# EAGLE design serendipboard_v2 (EAGLE 9.6.2)

## Sheet 1 of 2
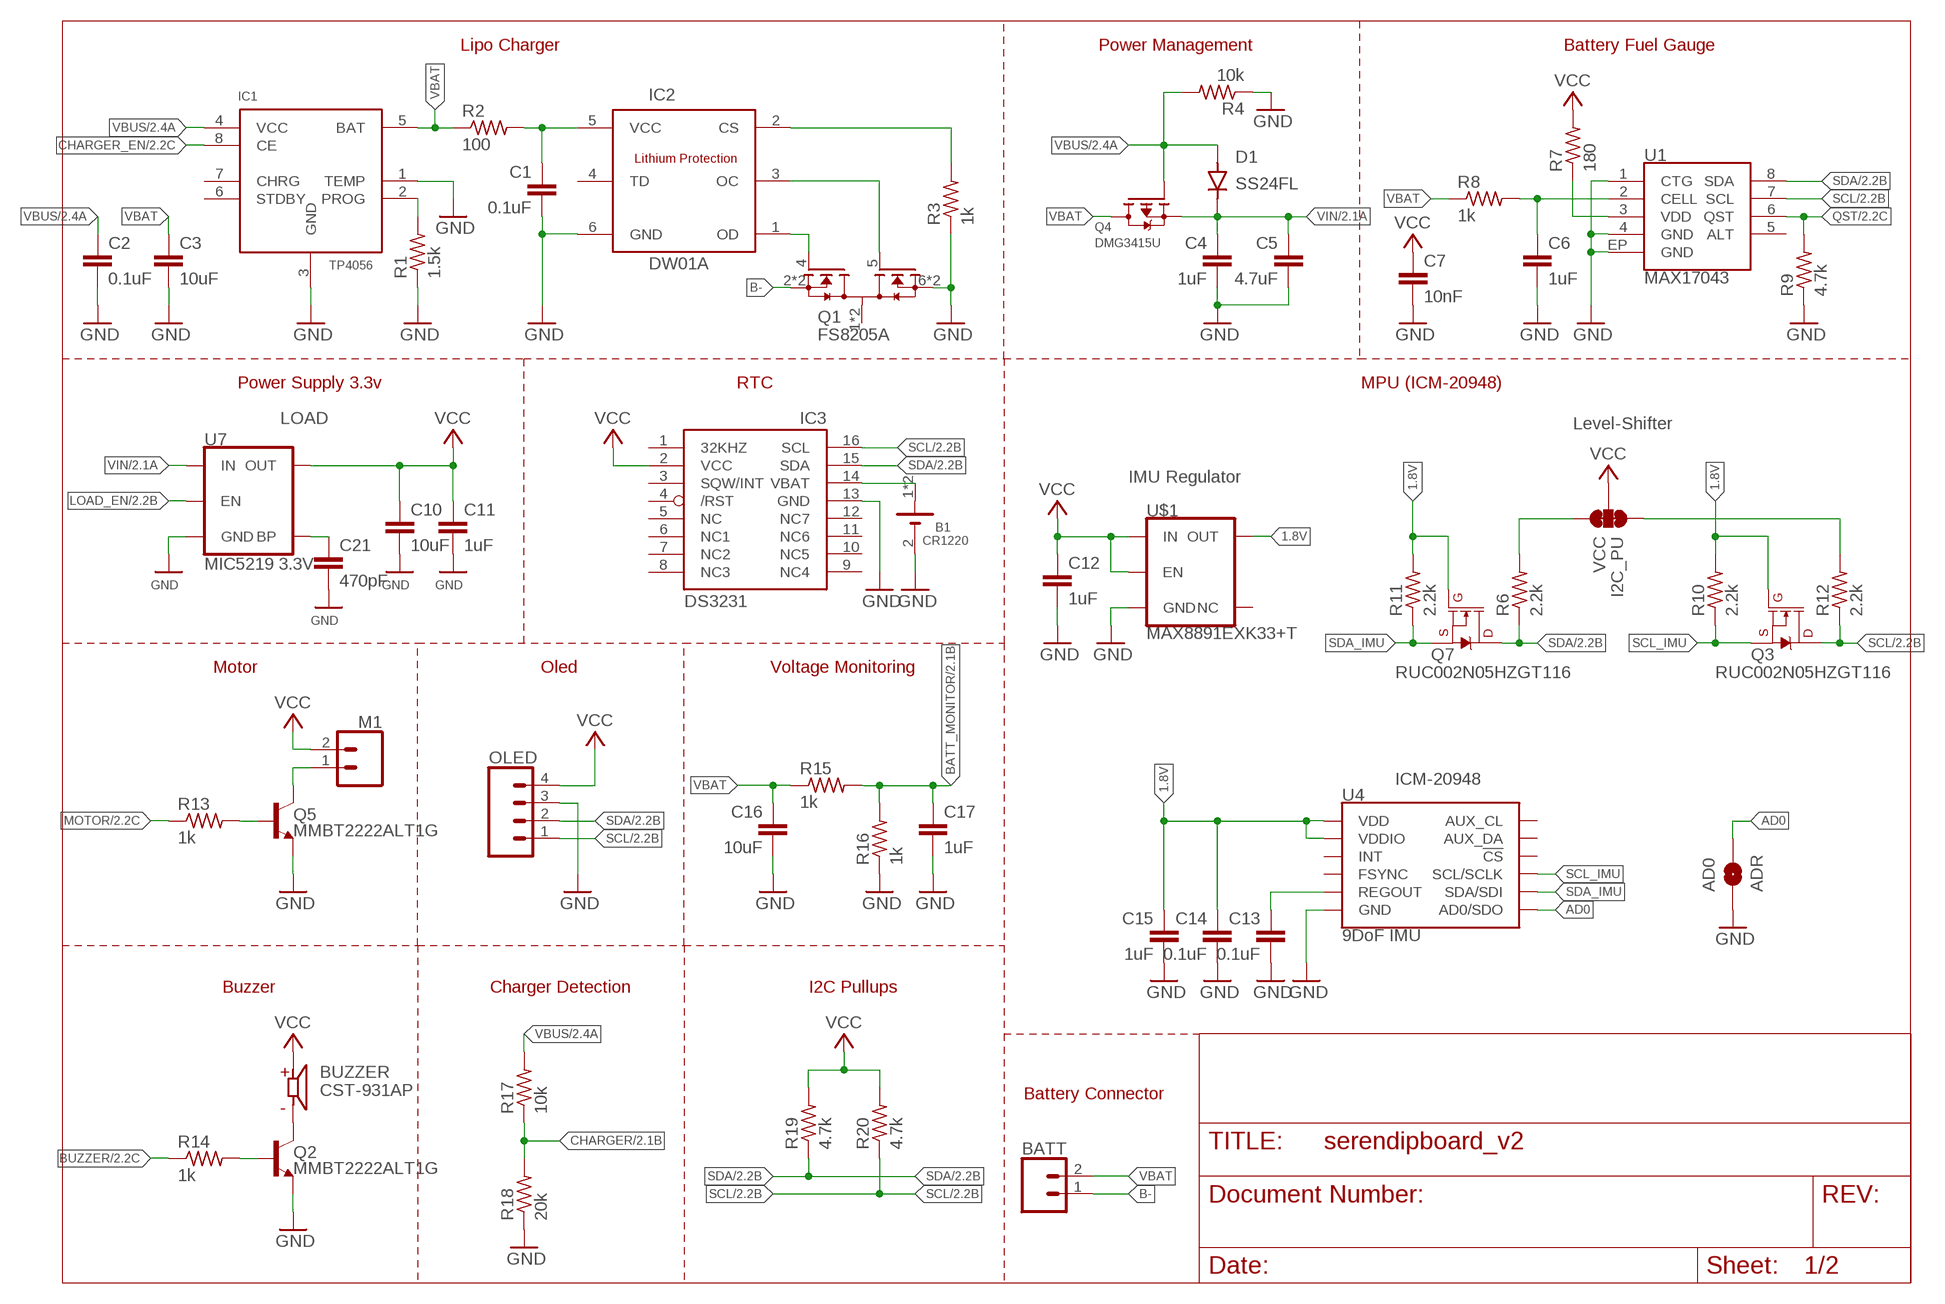
[diagram p0: schematic, sheet 1]

### Parts
AD0  ADR  JUMPER-SMT_2_NO_NO-SILK  [SMT-JUMPER_2_NO_NO-SILK]
B1  CR1220  3000TR  [BAT_3000TR]
BATT  CONN_02  [1X02]
BUZZER  CST-931AP  [CUI_CST-931AP]
C1  0.1uF  C-EUC0402  [C0402]
C2  0.1uF  C-EUC0402  [C0402]
C3  10uF  C-EUC0402  [C0402]
C4  1uF  C-EUC0402  [C0402]
C5  4.7uF  C-EUC0402  [C0402]
C6  1uF  C-EUC0402  [C0402]
C7  10nF  C-EUC0402  [C0402]
C10  10uF  C-EUC0402  [C0402]
C11  1uF  C-EUC0402  [C0402]
C12  1uF  C-EUC0402  [C0402]
C13  0.1uF  C-EUC0402  [C0402]
C14  0.1uF  C-EUC0402  [C0402]
C15  1uF  C-EUC0402  [C0402]
C16  10uF  C-EUC0402  [C0402]
C17  1uF  C-EUC0402  [C0402]
C21  470pF  C-EUC0402  [C0402]
D1  SS24FL  [SODFL3617X108N]
IC1  TP4056  [SOP-8]
IC2  DW01A  [SOT23-6]
IC3  DS3231/SO  [SO16W]
M1  CONN_02  [1X02]
OLED  CONN_04PTH  [1X04]
Q1  FS8205A  [SOP65P640X120-8N]
Q2  MMBT2222ALT1G  TRANS_NPN-MMBT2222AL  [SOT23-3]
Q3  RUC002N05HZGT116  MOSFET-NCH-AO3404A  [SOT23-3]
Q4  DMG3415U  MOSFET-P  [SOT23-R]
Q5  MMBT2222ALT1G  TRANS_NPN-MMBT2222AL  [SOT23-3]
Q7  RUC002N05HZGT116  MOSFET-NCH-AO3404A  [SOT23-3]
R1  1.5k  R-US_R0402  [R0402]
R2  100  R-US_R0402  [R0402]
R3  1k  R-US_R0402  [R0402]
R4  10k  R-US_R0402  [R0402]
R6  2.2k  R-US_R0402  [R0402]
R7  180  R-US_R0402  [R0402]
R8  1k  R-US_R0402  [R0402]
R9  4.7k  R-US_R0402  [R0402]
R10  2.2k  R-US_R0402  [R0402]
R11  2.2k  R-US_R0402  [R0402]
R12  2.2k  R-US_R0402  [R0402]
R13  1k  R-US_R0402  [R0402]
R14  1k  R-US_R0402  [R0402]
R15  1k  R-US_R0402  [R0402]
R16  1k  R-US_R0402  [R0402]
R17  10k  R-US_R0402  [R0402]
R18  20k  R-US_R0402  [R0402]
R19  4.7k  R-US_R0402  [R0402]
R20  4.7k  R-US_R0402  [R0402]
U1  MAX17043  MAX1704X  [TDFN-8]
U4  9DoF IMU  ICM-20948  [QFN24-3X3-ICM-20948]
U7  MIC5219 3.3V  V_REG_MIC52193.3V  [SOT23-5]
U$1  MAX8891EXK33+T  V_REG_SP6214-1.8V  [SC70]
VCC  I2C_PU  JUMPER-SMT_3_2-NC_TRACE_NO-SILK  [SMT-JUMPER_3_2-NC_TRACE_NO-SILK]

### Nets
1.8V: C14.1 C15.1 Q3.1(G) Q7.1(G) R10.2 R11.2 U4.8(VDDIO) U4.13(VDD) U$1.5(OUT)
AD0: AD0.2 U4.9(AD0/SDO)
B-: BATT.1 Q1.2(S1) Q1.3(S1)
BATT_MONITOR: C17.1 R15.2 R16.2 ; also sheet 2
BUZZER: R14.1 ; also sheet 2
CHARGER: R17.1 R18.2 ; also sheet 2
CHARGER_EN: IC1.8(CE) ; also sheet 2
GND: AD0.1 B1.2(-) C1.2 C2.2 C3.2 C4.2 C5.2 C6.2 C7.2 C10.2 C11.2 C12.2 C13.2 C14.2 C15.2 C16.2 C17.2 C21.2 IC1.1(TEMP) IC1.3(GND) IC2.6(GND) IC3.13(GND) OLED.3 Q1.6(S2) Q1.7(S2) Q2.2(E) Q5.2(E) R1.1 R3.1 R4.1 R9.1 R16.1 R18.1 U1.1(CTG) U1.4(GND) U1.EP(GND) U4.18(GND) U4.20(GND) U7.2(GND) U$1.2(GND) ; also sheet 2
LOAD_EN: U7.3(EN) ; also sheet 2
MOTOR: R13.1 ; also sheet 2
N$1: IC1.2(PROG) R1.2
N$2: IC2.3(OC) Q1.5(G2)
N$3: C1.1 IC2.5(VCC) R2.2
N$4: IC2.1(OD) Q1.4(G1)
N$5: IC2.2(CS) R3.2
N$6: R7.1 U1.3(VDD)
N$7: C6.1 R8.2 U1.2(CELL)
N$9: B1.1(+) B1.3(+) IC3.14(VBAT)
N$10: R6.2 VCC.3
N$11: C13.1 U4.10(REGOUT)
N$12: R12.2 VCC.1
N$13: Q5.1(B) R13.2
N$14: Q2.1(B) R14.2
N$17: M1.1 Q5.3(C)
N$19: BUZZER.M Q2.3(C)
N$25: C21.1 U7.4(BP)
QST: R9.2 U1.6(QST) ; also sheet 2
SCL: IC3.16(SCL) OLED.1 Q3.3(D) R12.1 R20.1 U1.7(SCL) ; also sheet 2
SCL_IMU: Q3.2(S) R10.1 U4.23(SCL/SCLK)
SDA: IC3.15(SDA) OLED.2 Q7.3(D) R6.1 R19.1 U1.8(SDA) ; also sheet 2
SDA_IMU: Q7.2(S) R11.1 U4.24(SDA/SDI)
VBAT: BATT.2 C3.1 C16.1 IC1.5(BAT) Q4.3(D) R2.1 R8.1 R15.1
VBUS: C2.1 D1.A IC1.4(VCC) Q4.1(G) R4.2 R17.2 ; also sheet 2
VCC: BUZZER.P C7.1 C10.1 C11.1 C12.1 IC3.2(VCC) M1.2 OLED.4 R7.2 R19.2 R20.2 U7.5(OUT) U$1.1(IN) U$1.3(EN) VCC.2
VIN: C4.1 C5.1 D1.C Q4.2(S) U7.1(IN) ; also sheet 2
Unconnected: IC1.6(STDBY) IC1.7(CHRG) IC2.4(TD) IC3.1(32KHZ) IC3.3(SQW/INT) IC3.4(/RST) IC3.5(NC) IC3.6(NC1) IC3.7(NC2) IC3.8(NC3) IC3.9(NC4) IC3.10(NC5) IC3.11(NC6) IC3.12(NC7) Q1.1(D12) Q1.8(D12) U1.5(ALT) U4.7(AUX_CL) U4.11(FSYNC) U4.12(INT) U4.21(AUX_DA) U4.22(!CS) U$1.4(NC)

### Notes on the sheet
- Lipo Charger | Power Management | Battery Fuel Gauge
- Power Supply 3.3v | RTC | MPU (ICM-20948)
- LOAD
- Level-Shifter
- IMU Regulator
- Motor | Oled | Voltage Monitoring
- ICM-20948
- Buzzer | Charger Detection | I2C Pullups
- Battery Connector

## Sheet 2 of 2
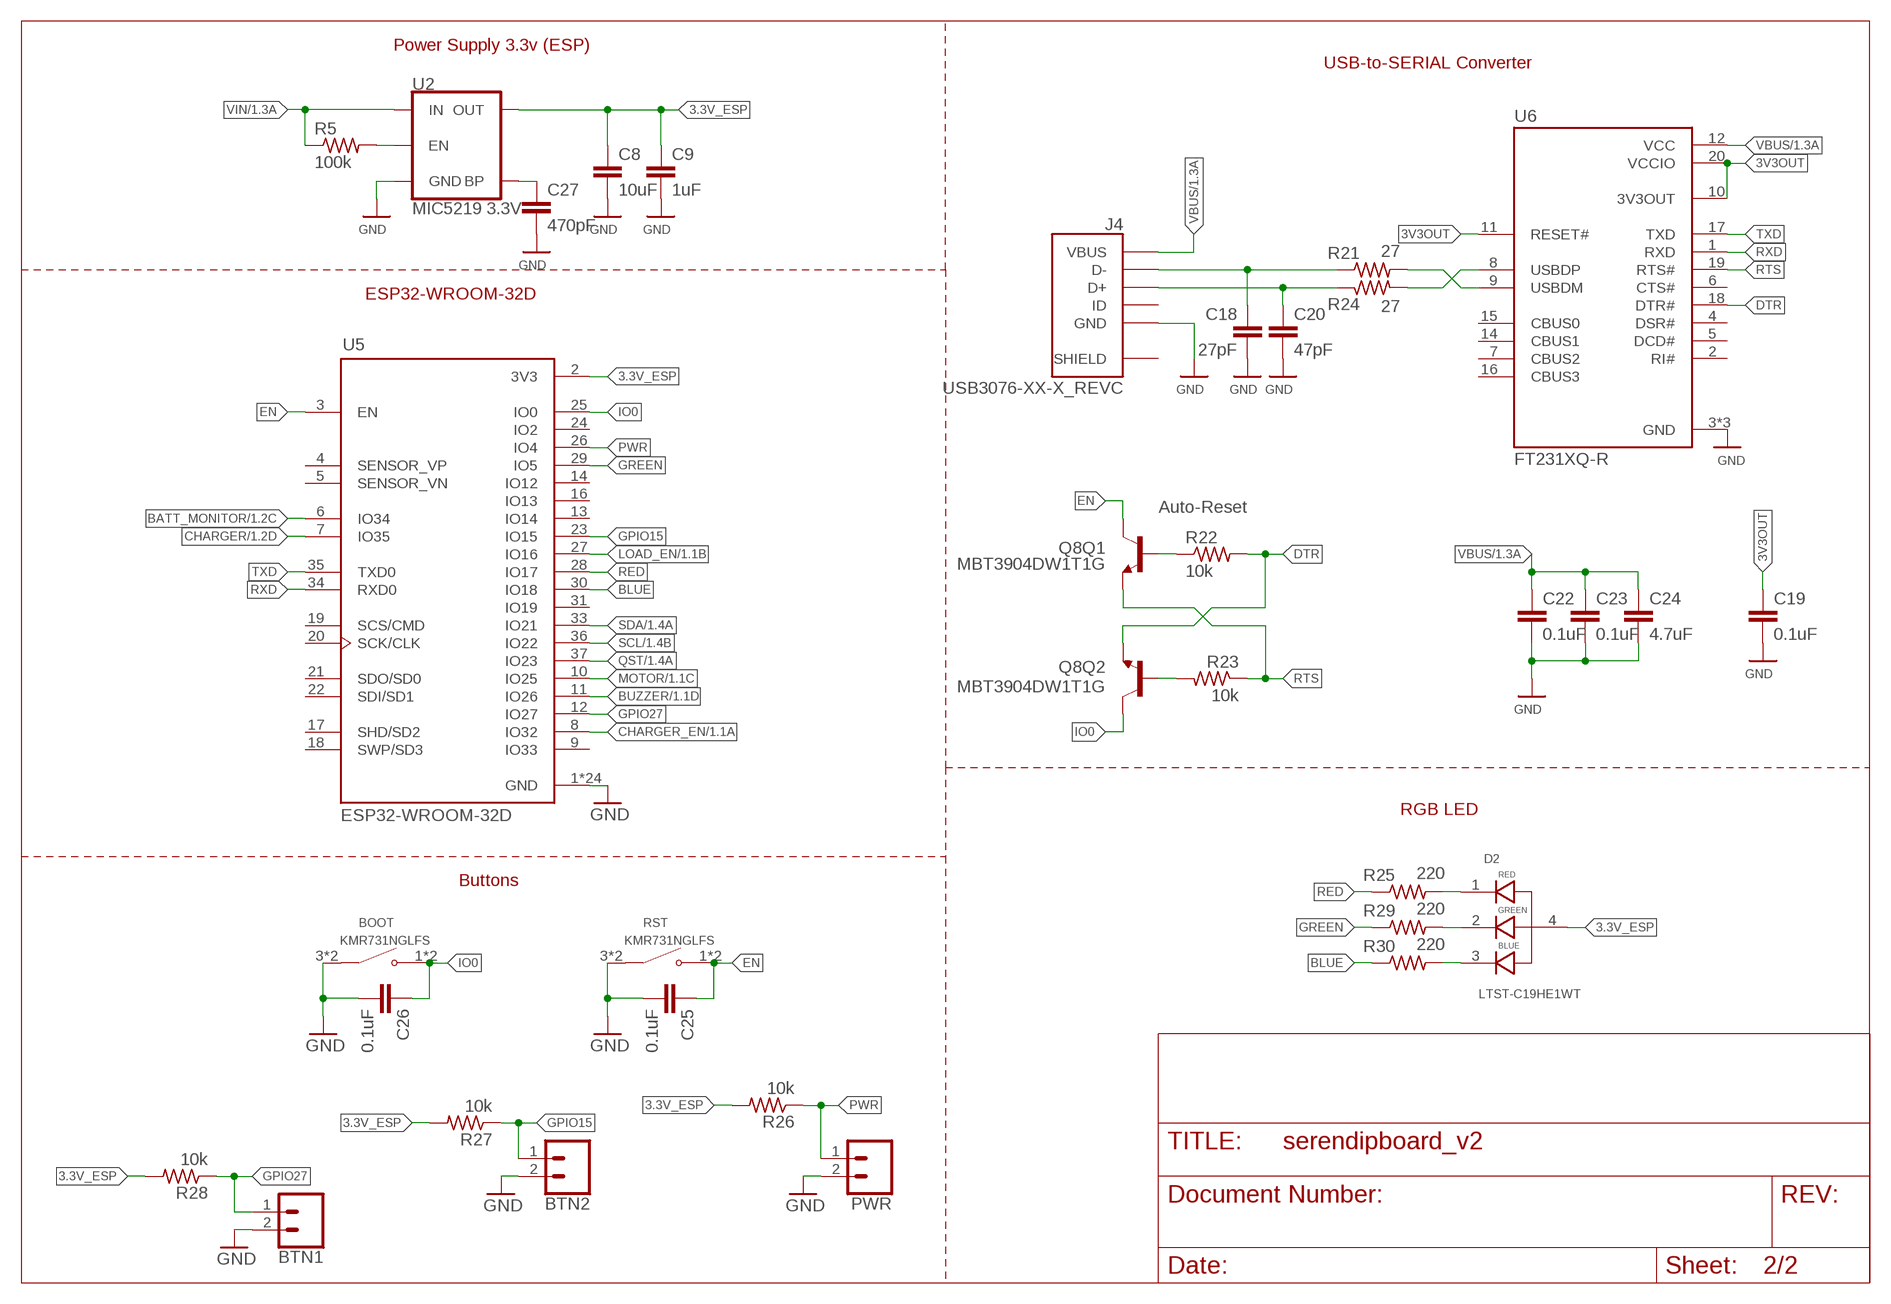
[diagram p1: schematic, sheet 2]

### Parts
BOOT  KMR731NGLFS  [SW_KMR731NGLFS]
BTN1  CONN_02  [1X02]
BTN2  CONN_02  [1X02]
C8  10uF  C-EUC0402  [C0402]
C9  1uF  C-EUC0402  [C0402]
C18  27pF  C-EUC0402  [C0402]
C19  0.1uF  C-EUC0402  [C0402]
C20  47pF  C-EUC0402  [C0402]
C22  0.1uF  C-EUC0402  [C0402]
C23  0.1uF  C-EUC0402  [C0402]
C24  4.7uF  C-EUC0402  [C0402]
C25  0.1uF  C-EUC0402  [C0402]
C26  0.1uF  C-EUC0402  [C0402]
C27  470pF  C-EUC0402  [C0402]
D2  LTST-C19HE1WT  [LED_LTST-C19HE1WT]
J4  USB3076-XX-X_REVC  [GCT_USB3076-XX-X_REVC]
PWR  CONN_02  [1X02]
Q8  MBT3904DW1T1G  TRANS_NPN_DUAL-MBT3904DW1T1  [SC70-6]
R5  100k  R-US_R0402  [R0402]
R21  27  R-US_R0402  [R0402]
R22  10k  R-US_R0402  [R0402]
R23  10k  R-US_R0402  [R0402]
R24  27  R-US_R0402  [R0402]
R25  220  R-US_R0402  [R0402]
R26  10k  R-US_R0402  [R0402]
R27  10k  R-US_R0402  [R0402]
R28  10k  R-US_R0402  [R0402]
R29  220  R-US_R0402  [R0402]
R30  220  R-US_R0402  [R0402]
RST  KMR731NGLFS  [SW_KMR731NGLFS]
U2  MIC5219 3.3V  V_REG_MIC52193.3V  [SOT23-5]
U5  ESP32-WROOM-32D  [MODULE_ESP32-WROOM-32D]
U6  FT231XQ-R  [QFN50P400X400X80-21N]

### Nets
3.3V_ESP: C8.1 C9.1 D2.4 R26.2 R27.2 R28.2 U2.5(OUT) U5.2(3V3)
3V3OUT: C19.1 U6.10(3V3OUT) U6.11(RESET#) U6.20(VCCIO)
BATT_MONITOR: U5.6(IO34) ; also sheet 1
BLUE: R30.1 U5.30(IO18)
BUZZER: U5.11(IO26) ; also sheet 1
CHARGER: U5.7(IO35) ; also sheet 1
CHARGER_EN: U5.8(IO32) ; also sheet 1
DTR: Q8.1(Q2:E) R22.2 U6.18(DTR#)
EN: C25.1 Q8.3(Q1:C) RST.1(NO) RST.2(NO) U5.3(EN)
GND: BOOT.3(COM) BOOT.4(COM) BTN1.2 BTN2.2 C8.2 C9.2 C18.2 C19.2 C20.2 C22.2 C23.2 C24.2 C25.2 C26.2 C27.2 J4.5(GND) PWR.2 RST.3(COM) RST.4(COM) U2.2(GND) U5.1(GND) U5.15(GND) U5.38(GND) U5.39_1(GND) U5.39_2(GND) U5.39_3(GND) U5.39_4(GND) U5.39_5(GND) U5.39_6(GND) U5.39_7(GND) U5.39_8(GND) U5.39_9(GND) U5.39_10(GND) U5.39_11(GND) U5.39_12(GND) U5.39_13(GND) U5.39_14(GND) U5.39_15(GND) U5.39_16(GND) U5.39_17(GND) U5.39_18(GND) U5.39_19(GND) U5.39_20(GND) U5.39_21(GND) U6.3(GND) U6.13(GND) U6.21(GND) ; also sheet 1
GPIO15: BTN2.1 R27.1 U5.23(IO15)
GPIO27: BTN1.1 R28.1 U5.12(IO27)
GREEN: R29.1 U5.29(IO5)
IO0: BOOT.1(NO) BOOT.2(NO) C26.1 Q8.6(Q2:C) U5.25(IO0)
LOAD_EN: U5.27(IO16) ; also sheet 1
MOTOR: U5.10(IO25) ; also sheet 1
N$8: C27.1 U2.4(BP)
N$15: Q8.5(Q1:B) R22.1
N$16: C18.1 J4.2(D-) R21.1
N$18: Q8.2(Q2:B) R23.2
N$20: R21.2 U6.9(USBDM)
N$21: C20.1 J4.3(D+) R24.1
N$22: R24.2 U6.8(USBDP)
N$23: R5.2 U2.3(EN)
N$24: D2.1 R25.2
N$26: D2.2 R29.2
N$27: D2.3 R30.2
PWR: PWR.1 R26.1 U5.26(IO4)
QST: U5.37(IO23) ; also sheet 1
RED: R25.1 U5.28(IO17)
RTS: Q8.4(Q1:E) R23.1 U6.19(RTS#)
RXD: U5.34(RXD0) U6.1(RXD)
SCL: U5.36(IO22) ; also sheet 1
SDA: U5.33(IO21) ; also sheet 1
TXD: U5.35(TXD0) U6.17(TXD)
VBUS: C22.1 C23.1 C24.1 J4.1(VBUS) U6.12(VCC) ; also sheet 1
VIN: R5.1 U2.1(IN) ; also sheet 1
Unconnected: J4.4(ID) U5.4(SENSOR_VP) U5.5(SENSOR_VN) U5.9(IO33) U5.13(IO14) U5.14(IO12) U5.16(IO13) U5.17(SHD/SD2) U5.18(SWP/SD3) U5.19(SCS/CMD) U5.20(SCK/CLK) U5.21(SDO/SD0) U5.22(SDI/SD1) U5.24(IO2) U5.31(IO19) U6.2(RI#) U6.4(DSR#) U6.5(DCD#) U6.6(CTS#) U6.7(CBUS2) U6.14(CBUS1) U6.15(CBUS0) U6.16(CBUS3)

### Notes on the sheet
- Power Supply 3.3v (ESP)
- USB-to-SERIAL Converter
- ESP32-WROOM-32D
- Auto-Reset
- RGB LED
- Buttons

## Power pins joined to a net without a drawn wire
SHIELD: J4.6(SHIELD) J4.7(SHIELD) J4.8(SHIELD) J4.9(SHIELD) J4.10(SHIELD) J4.11(SHIELD)

## Library data of the parts
AD0 = SparkFun-Jumpers:JUMPER-SMT_2_NO: Normally open jumper This jumper has two pads in close proximity to each other. Apply solder to close the connection. Round pads are easier to solder for beginners, but are a lot larger. SparkFun Product that uses the round pads: SparkFun EL Sequencer <https://www.sparkfun.com/products/12781>
B1 = 3000TR:3000TR: Ultra Low Profile SMT Coin Cell Battery Contact Retainer for 12 mm Cell Check prices <https://pricing.snapeda.com/parts/3000TR/Keystone/view-part?ref=eda>; AVAILABILITY: Warning; DESCRIPTION: SMT Holder for 12mm Cell-Tin Nickel Plate on T&R; MF: Keystone; MP: 3000TR; PACKAGE: None; PRICE: None; PURCHASE-URL: https://pricing.snapeda.com/search/part/3000TR/?ref=eda; WEBLINK: https://www.mouser.com/ProductDetail/Keystone-Electronics/3000TR?utm_medium=online&utm_content=model&utm_source=snapedaonline&utm_campaign=mouser&qs=811De8TLL%252BeRUCmGL5ZsKg%3D%3D
BATT BTN1 BTN2 M1 PWR = SparkFun-Connectors:CONN_02: Multi connection point. Often used as Generic Header-pin footprint for 0.1 inch spaced/style header connections On any of the 0.1 inch spaced packages, you can populate with these: Break Away Headers - Straight <https://www.sparkfun.com/products/116> (PRT-00116) Break Away Male Headers - Right Angle <https://www.sparkfun.com/products/553> (PRT-00553) Female Headers <https://www.sparkfun.com/products/115> (PRT-00115) Break Away Headers - Machine Pin <https://www.sparkfun.com/products/117> (PRT-00117) Break Away Female Headers - Swiss Machine Pin <https://www.sparkfun.com/products/743> (PRT-00743) For SCREWTERMINALS and SPRING TERMINALS visit here: Screw Terimnals on SparkFun.com <https://www.sparkfun.com/search/results?term=Screw+Terminals> (5mm/3.5mm/2.54mm spacing) This device is also useful as a general connection point to wire up your design to another part of your project. Our various solder wires solder well into these plated through hole pads. Hook-Up Wire - Assortment (Stranded, 22 AWG) <https://www.sparkfun.com/products/11375> (PRT-11375) Hook-Up Wire - Assortment (Solid Core, 22 AWG) <https://www.sparkfun.com/products/11367> (PRT-11367) View the entire wire category on our website here <https://www.sparkfun.com/categories/141> Special notes: Molex polarized connector foot print use with: PRT-08233 with associated crimp pins and housings. 2.54_SCREWTERM for use with PRT-10571. 3.5mm Screw Terminal footprints for PRT-08084 5mm Screw Terminal footprints for use with PRT-08432
BOOT RST = KMR731NGLFS:KMR731NGLFS: Tactile Switch SPST-NO Top Actuated Surface Mount Check prices <https://pricing.snapeda.com/parts/KMR731NGLFS/C%26K/view-part?ref=eda>; AVAILABILITY: Good; DESCRIPTION: Tactile Switch SPST-NO Top Actuated Surface Mount; MF: C&K; MP: KMR731NGLFS; PACKAGE: None; PRICE: None; PURCHASE-URL: https://pricing.snapeda.com/search/part/KMR731NGLFS/?ref=eda; WEBLINK: https://www.mouser.com/ProductDetail/CK/KMR731NGLFS?utm_medium=online&utm_source=snapedaonline&utm_content=model&utm_campaign=mouser&qs=HXFqYaX1Q2zvDMPiZo53qg%3D%3D
BUZZER = CST-931AP:CST-931AP: 9 mm, 3 V, 85 dB, Through Hole, Magnetic Audio Transducer Buzzer Check prices <https://pricing.snapeda.com/parts/CST-931AP/CUI%20Devices/view-part?ref=eda>; AVAILABILITY: Good; CUI_PURCHASE_URL: https://www.cuidevices.com/product/audio/buzzers/audio-transducers/cst-931ap?utm_source=snapeda.com&utm_medium=referral&utm_campaign=snapedaBOM; DESCRIPTION: 9 mm, 3 V, 85 dB, Through Hole, Magnetic Audio Transducer Buzzer; MF: CUI Devices; MP: CST-931AP; PACKAGE: CUI Inc.; PRICE: None; PURCHASE-URL: https://pricing.snapeda.com/search/part/CST-931AP/?ref=eda
C1-C20 C22-C26 = rcl:C-EU: CAPACITOR, European symbol; SPICEPREFIX: C
C21 C27 = rcl:C-EU: CAPACITOR, European symbol; SPICEPREFIX: C; WEBLINK: https://www.mouser.com/ProductDetail/KEMET/C0402C471J1GACAUTO?qs=sGAEpiMZZMukHu%252BjC5l7YWbgIG6EVcU0CY2rIdfmFUs%3D
D1 = SS24FL:SS24FL: Diode Schottky Barrier Rectifier 30V 1A 2-Pin SOD-123F T/R Check prices <https://pricing.snapeda.com/parts/SS24FL/ON%20Semiconductor/view-part?ref=eda>; AVAILABILITY: Good; DESCRIPTION: Diode Schottky 40V 2A Surface Mount SOD-123F; MF: ON Semiconductor; MP: SS24FL; PACKAGE: SOD-123 FL-2 ON Semiconductor; PRICE: None; PURCHASE-URL: https://pricing.snapeda.com/search/part/SS24FL/?ref=eda; WEBLINK: https://www.mouser.com/ProductDetail/ON-Semiconductor-Fairchild/SS24FL?qs=%2Fha2pyFaduj7KkQLupkD5BNnzhQnWfnoQdoJ200unmI%3D
D2 = LTST-C19HE1WT:LTST-C19HE1WT: Red, Green, Blue (RGB) 624nm Red, 525nm Green, 470nm Blue LED Indication - Discrete 2.1V Red, 3.35V Green, 3.35V Blue 0606 (1616 Metric) Check prices <https://pricing.snapeda.com/parts/LTST-C19HE1WT/Lite-On%20Electronics/view-part?ref=eda>; AVAILABILITY: Good; DESCRIPTION: LED Tri-Color Blue/Green/Red 468nm/520nm/632nm 4-Pin SMD T/R; MF: Lite-On Electronics; MP: LTST-C19HE1WT; PACKAGE: None; PRICE: None; PURCHASE-URL: https://pricing.snapeda.com/search/part/LTST-C19HE1WT/?ref=eda; WEBLINK: https://www.mouser.com/ProductDetail/Lite-On/LTST-C19HE1WT?qs=WAWaI72GHKxJLPArJA9%252BUw%3D%3D&utm_campaign=mouser&utm_content=model&utm_source=snapedaonline&utm_medium=online
IC1 = TP4056:TP4056; AVAILABILITY: Unavailable; DESCRIPTION: Complete single cell Li-Ion battery with a constant current / constant voltage linear charger; MF: NanJing Top Power ASIC Corp.; MP: TP4056; PACKAGE: Package; PRICE: None; WEBLINK: https://lcsc.com/product-detail/PMIC-Battery-Management_UMW-Youtai-Semiconductor-Co-Ltd-TP4056_C725790.html
IC2 = DW01A:DW01A; AVAILABILITY: Unavailable; DESCRIPTION: One Cell Lithium-ion/Polymer Battery Protection IC; MF: Fortune Semiconductor; MP: DW01A; PACKAGE: SOT-23-6 Fortune Semiconductor; PRICE: None; WEBLINK: https://lcsc.com/product-detail/Battery-Protection-ICs_PUOLOP-DW01A_C351410.html
IC3 = DS3231:DS3231; AVAILABILITY: Unavailable; DESCRIPTION: Real Time Clock (RTC) IC Clock/Calendar I²C, 2-Wire Serial 16-SOIC (0.295, 7.50mm Width); MF: Maxim Integrated; MP: DS3231; PACKAGE: SOIC-16 Maxim Integrated; PRICE: None; WEBLINK: https://www.mouser.com/ProductDetail/Maxim-Integrated/DS3231SN?qs=1eQvB6Dk1vhUlr8%2FOrV0Fw%3D%3D
J4 = USB3076-30-A:USB3076-XX-X_REVC: Micro USB Receptacle, Type B, SMT, Horizontal, Bottom Mount w/out Peg, w/out Shell Stakes, w/out Mating Face Lead-In Check prices <https://pricing.snapeda.com/parts/USB3076-30-A/Global%20Connector%20Technology/view-part?ref=eda>; AVAILABILITY: Warning; DESCRIPTION: USB - micro B USB 2.0 Receptacle Connector 5 Position Surface Mount, Right Angle; Through Hole, 2.35mm profile, 5 Pins, Horizontal, Bottom mount; MF: Global Connector Technology; MP: USB3076-30-A; PACKAGE: None; PRICE: None; PURCHASE-URL: https://pricing.snapeda.com/search/part/USB3076-30-A/?ref=eda; WEBLINK: https://www.digikey.com/en/products/detail/gct/USB3076-30-A/9859635?s=N4IgTCBcDaIKoGUBCBmADAdgGwFp04EEQBdAXyA
OLED = SparkFun-Connectors:CONN_04: Multi connection point. Often used as Generic Header-pin footprint for 0.1 inch spaced/style header connections On any of the 0.1 inch spaced packages, you can populate with these: Break Away Headers - Straight <https://www.sparkfun.com/products/116> (PRT-00116) Break Away Male Headers - Right Angle <https://www.sparkfun.com/products/553> (PRT-00553) Female Headers <https://www.sparkfun.com/products/115> (PRT-00115) Break Away Headers - Machine Pin <https://www.sparkfun.com/products/117> (PRT-00117) Break Away Female Headers - Swiss Machine Pin <https://www.sparkfun.com/products/743> (PRT-00743) For SCREWTERMINALS and SPRING TERMINALS visit here: Screw Terimnals on SparkFun.com <https://www.sparkfun.com/search/results?term=Screw+Terminals> (5mm/3.5mm/2.54mm spacing) This device is also useful as a general connection point to wire up your design to another part of your project. Our various solder wires solder well into these plated through hole pads. Hook-Up Wire - Assortment (Stranded, 22 AWG) <https://www.sparkfun.com/products/11375> (PRT-11375) Hook-Up Wire - Assortment (Solid Core, 22 AWG) <https://www.sparkfun.com/products/11367> (PRT-11367) View the entire wire category on our website here <https://www.sparkfun.com/categories/141> Special notes: Molex polarized connector foot print use with SKU : PRT-08231 with associated crimp pins and housings. 1MM SMD Version SKU: PRT-10208; PROD_ID: CONN-09696
Q1 = FS8205A:FS8205A: N/A; AVAILABILITY: Unavailable; MF: Fortune Semiconductor; MP: FS8205A; PACKAGE: Package; PRICE: None; WEBLINK: https://lcsc.com/product-detail/MOSFET_FUXINSEMI-FS8205A_C908265.html
Q2 Q5 = SparkFun-DiscreteSemi:TRANS_NPN: NPN transistor Current controlled devices typically used to amplify current or used as a switch. BC547 - COM-08928 <http://www.sparkfun.com/products/8928> (TO-92 45V 100mA) (1.Collector 2.Base 3.Emitter) 2N3904 - COM-00521 <http://www.sparkfun.com/products/521> (TO-92 40V 200mA) (1.Emitter 2.Base 3.Collector) P2N2222A - COM-12852 <http://www.sparkfun.com/products/12852> (TO-92 40V 600mA) (1.Collector 2.Base 3.Emitter); PROD_ID: TRANS-08049; VALUE: 600mA/40V; WEBLINK: https://www.mouser.com/ProductDetail/ON-Semiconductor/MMBT2222ALT1G?qs=HVbQlW5zcXWwnD7Jokybqg%3D%3D
Q3 Q7 = SparkFun-DiscreteSemi:MOSFET-NCH: N-channel MOSFETs Voltage controlled devices that allow control of high current outputs. SparkFun Products: SparkFun OpenScale <https://www.sparkfun.com/products/13261> SparkFun Digital Sandbox <https://www.sparkfun.com/products/12651> SparkFun Monster Moto Shield <https://www.sparkfun.com/products/10182> SparkFun MOSFET Power Controller <https://www.sparkfun.com/products/11214>; PROD_ID: TRANS-12988; VALUE: 5.8A/30V/35mΩ; WEBLINK: https://www.mouser.com/ProductDetail/ROHM-Semiconductor/RUC002N05HZGT116?qs=4v%252BiZTmLVHE0lwSK%2FDyNsA%3D%3D
Q4 = microbuilder:MOSFET-P: P-Channel Mosfet LEGEND VDS: Voltage Drain-Source ID: Drain Current RDS(ON): Drain-Source On-State Resistance VGS(TH): Gate-Source Threshold Voltage CISS: Drain-Source Input Capacitance SOT-23 Name VDS ID RDS(ON) VGS(TH) CISS Order Number IRLML5103 30V 760mA 600 mOhm -- 75pF @ 25V Digikey: IRLML5103PBFCT-ND IRLML6401 12V 4.3A 50 mOhm 950mV @ 250µA 830pF @ 10V Digikey: IRLML6401PBFTR-ND NTR0202PL 20V 400mA 800 mOhm 2.3V @ 250uA 70pF @ 5V Digikey: NTR0202PLT1GOSTR-ND NTR4101PT1G 20V 1.8A 85 mOhm 1.2V @ 250uA 675pF @ 10V Digikey: NTR4101PT1GOSCT-ND DMP2004K 20V 600mA 900 mOhm 1V @ 250uA 175pF @ 16V Digikey: DMP2004KDICT-ND PMV65XP 20V 3.9A 76 mOhm 950mV @ 1mA 725pF @ 20V Digikey: 568-2358-2-ND TO-252 Name VDS ID RDS(ON) VGS(TH) CISS Order Number AOD417 30V 25A 34 mOhm 3V @ 250µA 920pF @ 15V Digikey: 785-1106-2-ND; WEBLINK: https://www.arrow.com/en/products/dmg3415uq-7/diodes-incorporated
Q8 = SparkFun-DiscreteSemi:TRANS_NPN_DUAL: Dual NPN Transistors in Single Package The MBT3904W1 puts two general purpose 3904 NPN transistors in a single package. Datasheet <http://www.onsemi.com/pub_link/Collateral/MBT3904DW1T1-D.PDF> SparkFun Products: SparkFun ESP32 Thing <https://www.sparkfun.com/products/13907>; PROD_ID: TRANS-13337; WEBLINK: https://www.mouser.com/ProductDetail/ON-Semiconductor/MBT3904DW1T1G?qs=3JMERSakebosaBSFCYL6kw%3D%3D
R1-R20 R22 R23 R25-R30 = rcl:R-US_: RESISTOR, American symbol; SPICEPREFIX: R
R21 R24 = rcl:R-US_: RESISTOR, American symbol; SPICEPREFIX: R; WEBLINK: https://www.mouser.com/ProductDetail/Panasonic/ERJ-UP3F27R0V?qs=GedFDFLaBXEZtGKa4W2A1A%3D%3D
U1 = SparkFun-IC-Power:MAX1704X: MAX17043/MAX17044: Battery Fuel Guage (43 is 1cell, 44 is 2cell); PROD-ID: IC-10399; WEBLINK: https://www.mouser.com/ProductDetail/Maxim-Integrated/MAX17043G%2bT?qs=fnYUjNMxfVCghHGFBrnbRA%3D%3D
U2 U7 = SparkFun-IC-Power:V_REG_MIC5219: V_REG MIC5219 Standard 3.3V and 5V 500mA LDO voltage regulator in SOT-23 layout. Micrel part MIC5219. BP (by-pass) pin is used to lower output noise with 470pF cap, may be left open.; PROD_ID: VREG-09872; WEBLINK: https://www.mouser.com/ProductDetail/Microchip-Technology-Micrel/MIC5219-33YM5-TR?qs=U6T8BxXiZAWojkIJMtSJlw%3D%3D
U4 = SparkFun-Sensors:ICM-20948: ICM-20948 9 Degree of Freedom IMU World’s lowest power 9-axis MotionTracking device that is ideally suited for smartphones, tablets, wearable sensors, and IoT applications. Includes onboard Digital Motion Processor to offload computations from the host processor Datasheet <https://cdn.sparkfun.com/assets/learn_tutorials/5/5/0/MPU9250REV1.0.pdf> SparkFun Products: SparkFun IMU Breakout - ICM-20948 <https://www.sparkfun.com/products/15182>; PROD_ID: IC-14247; WEBLINK: https://www.mouser.com/ProductDetail/TDK-InvenSense/ICM-20948?qs=%2Fha2pyFaduhVfJfZCXoikyvvC70YiWC%2FBNr%2FvcBEr1bv7usabPFmkg%3D%3D
U5 = ESP32-WROOM-32D:ESP32-WROOM-32D: Bluetooth, WiFi 802.11b/g/n, Bluetooth v4.2 + EDR, Class 1, 2 and 3 Transceiver Module 2.4GHz ~ 2.5GHz Integrated, Trace Surface Mount Check prices <https://pricing.snapeda.com/parts/ESP32-WROOM-32D/Espressif%20Systems/view-part?ref=eda>; AVAILABILITY: Bad; DESCRIPTION: Bluetooth, WiFi 802.11b/g/n, Bluetooth v4.2 +EDR, Class 1, 2 and 3 Transceiver Module 2.4GHz ~ 2.5GHz Integrated; MF: Espressif Systems; MP: ESP32-WROOM-32D; PACKAGE: Module Espressif Systems; PRICE: None; WEBLINK: https://www.mouser.com/ProductDetail/Espressif-Systems/ESP32-WROOM-32DM113DH2800PH3Q0?qs=W%2FMpXkg%252BdQ75%2Fda1rSxxJw%3D%3D
U6 = FT231XQ-R:FT231XQ-R: USB2.0 Full Speed IC offers a compact bridge to full handshake UART Interface Check prices <https://pricing.snapeda.com/parts/FT231XQ-R/FTDI%2C%20Future/view-part?ref=eda>; AVAILABILITY: Warning; DESCRIPTION: USB Bridge, USB to UART USB 2.0 UART Interface 20-QFN (4x4); MF: FTDI, Future; MP: FT231XQ-R; PACKAGE: QFN-20 FTDI; PRICE: None; PURCHASE-URL: https://pricing.snapeda.com/search/part/FT231XQ-R/?ref=eda; WEBLINK: https://www.mouser.com/ProductDetail/FTDI/FT231XQ-R?qs=Gp1Yz1mis3VkAf3iW%252BkumQ==
U$1 = SparkFun-IC-Power:V_REG_SP6214: Voltage Regulator - SP6214 SP6214 Series SC-70-5 Micropower SC-70 100 mA CMOS LDO Regulator Datasheet <https://www.exar.com/content/document.ashx?id=654> SparkFun Products: MP3 Trigger <https://www.sparkfun.com/products/13720> SparkFun Particle Sensor Breakout <https://www.sparkfun.com/products/14045>; PROD_ID: VREG-08428; VALUE: 1.8V/100mA; WEBLINK: https://www.mouser.com/ProductDetail/STMicroelectronics/LD39015M18R?qs=%2Fha2pyFaduiNd%2F2UEBkaLCKjQ2zo%2FZOF5RG39Zh4PEGsBkDRy2IG8Q%3D%3D
VCC = SparkFun-Jumpers:JUMPER-SMT_3_2-NC_TRACE: Normally closed trace jumper (2 of 2 connections) This jumper has a trace between all three pads so they are normally closed (NC). Use a razor knife to open the connection(s). For best results follow the IPC guidelines for cutting traces: Cutout at least 0.063 mm (0.005 in). Remove all loose material to clean up the cut area. Seal the cut with an approved epoxy. Reapply solder to reclose the connection(s).

## Board
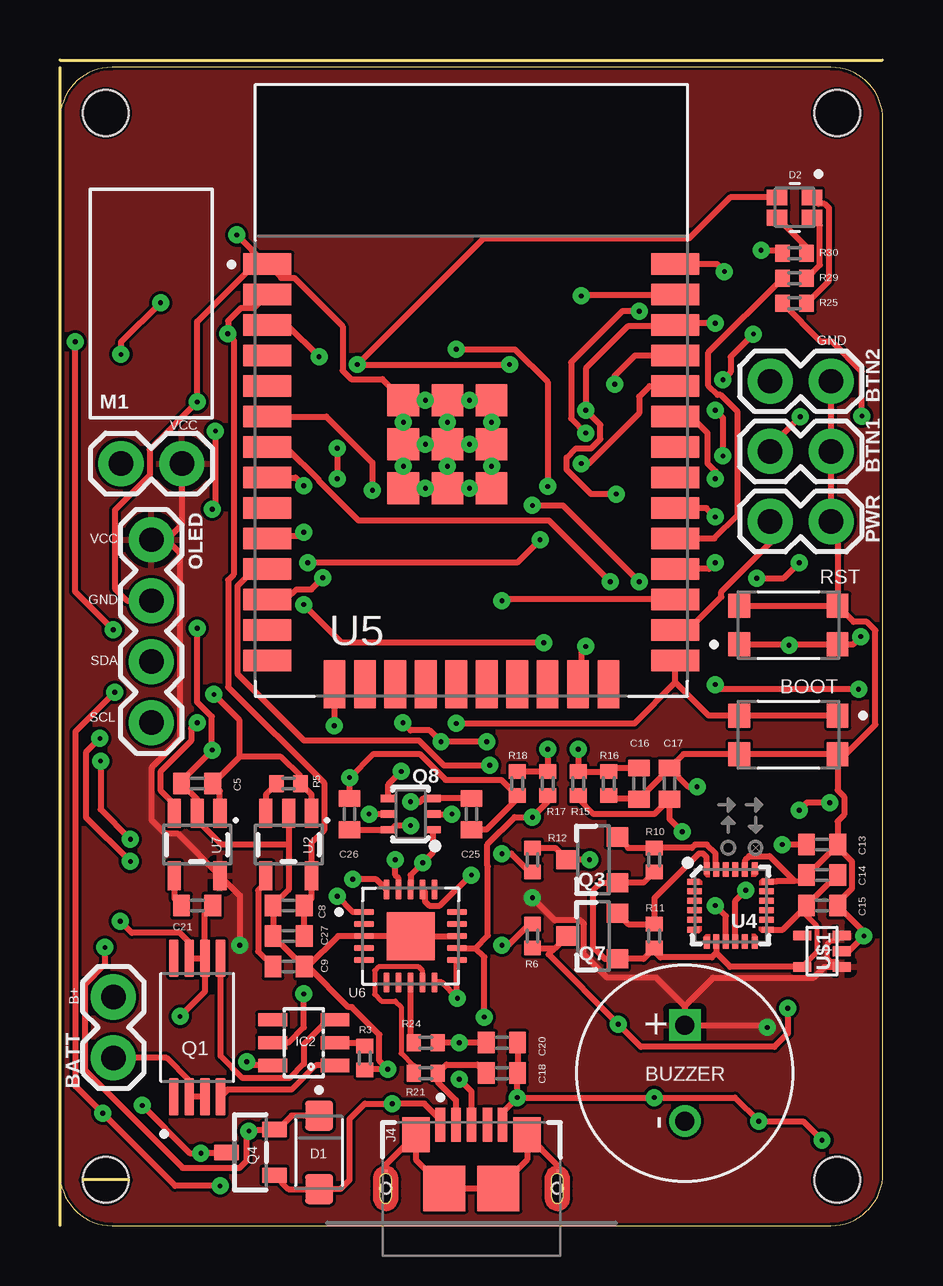
[diagram p2: board, top side]
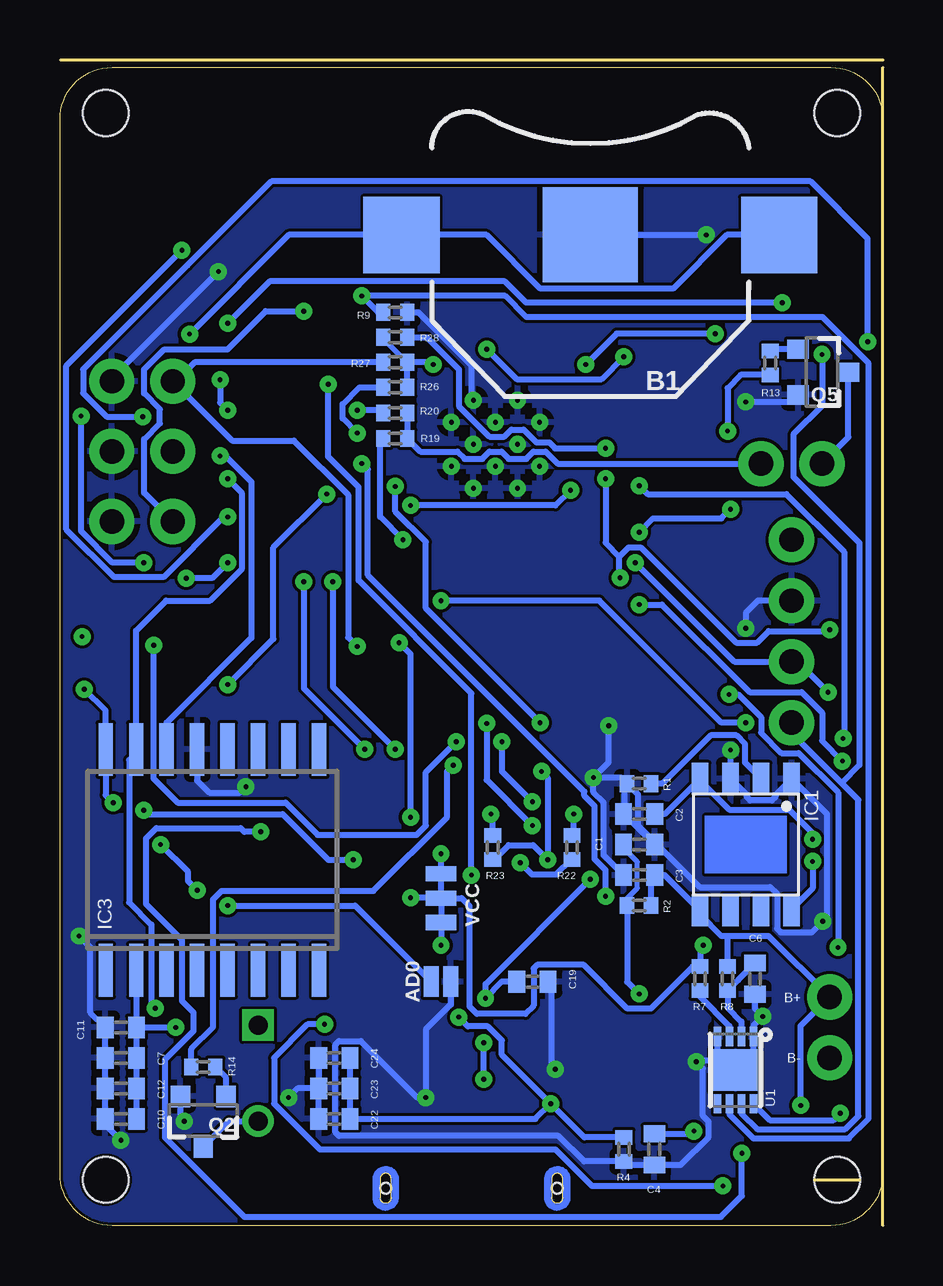
[diagram p3: board, bottom side, seen from below]

Size 34.29 x 48.26 mm. Coordinates in mm from the lower left corner, seen from the top.
Outline: 32.12,48.26 2.17,48.26 arc90 0,46.09 0,2.17 arc90 2.17,0 32.12,0 arc90 34.29,2.17 34.29,46.09 arc90 32.12,48.26
Copper layers (1*16): Top 0.035mm / dielectric 1.5mm / Bottom 0.035mm
Design rules "battery system (2)": minimum track width 10mil, minimum drill 0.2mm, track to track 5mil, track to pad 5mil, pad to pad 5mil, via to via 5mil, smd to smd 5mil, copper to edge 5mil, drill to drill 7mil, minimum pad ring 10mil, minimum via ring 10mil, stop-mask expansion 6mil, vias tented up to drill 6mil, thermal gap 10mil
Holes 1.91 mm at 1.91,1.91 32.38,1.91 32.38,46.35 1.91,46.35
Milling: 2 lines

### Footprints (pad centres in the part's own frame; a part is rotated, then mirrored left to right if it is on the bottom)
SMT-JUMPER_2_NO_NO-SILK = smd 0.635 x 1.27: 1 -0.406,0; 2 0.406,0
BAT_3000TR = smd 3.18 x 3.18: 1 -7.87,0; 3 7.87,0 | smd 3.96 x 3.96: 2 0,0
1X02 = drill 1.016 pad 1.88: 1 0,0; 2 2.54,0
SW_KMR731NGLFS = smd 1 x 0.9: 1 -0.8,2.05; 2 -0.8,-2.05; 3 0.8,-2.05; 4 0.8,2.05
CUI_CST-931AP = drill 0.8: M 2,0 | drill 0.8 square: P -2,0
C0402 = smd 0.7 x 0.9: 1 -0.65,0; 2 0.65,0
SODFL3617X108N = smd 1.25 x 1.16: A 1.53,0; C -1.53,0
LED_LTST-C19HE1WT = smd 0.65 x 0.85: 1 -0.425,0.725; 2 0.425,0.725; 3 0.425,-0.725; 4 -0.425,-0.725
SOP-8 = smd 1.3 x 0.7: 1 -2.75,1.905; 2 -2.75,0.635; 3 -2.75,-0.635; 4 -2.75,-1.905; 5 2.75,-1.905; 6 2.75,-0.635; 7 2.75,0.635; 8 2.75,1.905
SOT23-6 = smd 0.55 x 1.2: 1 -0.95,-1.3; 2 0,-1.3; 3 0.95,-1.3; 4 0.95,1.3; 5 0,1.3; 6 -0.95,1.3
SO16W = smd 0.6 x 2.2: 1 -4.445,-4.6; 2 -3.175,-4.6; 3 -1.905,-4.6; 4 -0.635,-4.6; 5 0.635,-4.6; 6 1.905,-4.6; 7 3.175,-4.6; 8 4.445,-4.6; 9 4.445,4.6; 10 3.175,4.6; 11 1.905,4.6; 12 0.635,4.6; 13 -0.635,4.6; 14 -1.905,4.6; 15 -3.175,4.6; 16 -4.445,4.6
GCT_USB3076-XX-X_REVC = smd 0.4 x 1.4: 1 -1.3,2.65; 2 -0.65,2.65; 3 0,2.65; 4 0.66,2.65; 5 1.3,2.65 | smd 0.1 x 0.1: 6 -3.549,0.73; 7 3.601,0.73 | smd 1.15 x 1.45: 8 -2.32,2.23; 9 2.32,2.23 | smd 1.75 x 1.9: 10 -1.125,0; 11 1.125,0 | hole 0.45: -3.575,0; 3.575,0
1X04 = drill 1.016 pad 1.88: 1 0,0; 2 2.54,0; 3 5.08,0; 4 7.62,0
SOP65P640X120-8N = smd 1.56 x 0.4: 1 -2.88,0.975; 2 -2.88,0.325; 3 -2.88,-0.325; 4 -2.88,-0.975; 5 2.88,-0.975; 6 2.88,-0.325; 7 2.88,0.325; 8 2.88,0.975
SOT23-3 = smd 0.8 x 0.9: 1 -0.95,-1; 2 0.95,-1; 3 0,1.1
SOT23-R = smd 0.635 x 1.016: 1 -0.95,-1; 2 0.95,-1; 3 0,1
SC70-6 = smd 0.3 x 0.66: 1 -0.65,-0.92; 2 0,-0.92; 3 0.65,-0.92; 4 0.65,0.92; 5 0,0.92; 6 -0.65,0.92
R0402 = smd 0.6 x 0.7: 1 -0.5,0; 2 0.5,0
TDFN-8 = smd 0.8 x 0.3: 1 -1.4,0.75; 2 -1.4,0.25; 3 -1.4,-0.25; 4 -1.4,-0.75; 5 1.4,-0.75; 6 1.4,-0.25; 7 1.4,0.25; 8 1.4,0.75 | smd 1.73 x 1.88: EP 0,0
SOT23-5 = smd 0.55 x 1.2: 1 -0.95,-1.3; 2 0,-1.3; 3 0.95,-1.3; 4 0.95,1.3; 5 -0.95,1.3
QFN24-3X3-ICM-20948 = smd 0.495 x 0.25: 1 -1.552,1; 6 -1.552,-1; 13 1.552,-1; 18 1.552,1 | smd 0.6 x 0.25: 2 -1.5,0.6; 3 -1.5,0.2; 4 -1.5,-0.2; 5 -1.5,-0.6; 14 1.5,-0.6; 15 1.5,-0.2; 16 1.5,0.2; 17 1.5,0.6 | smd 0.25 x 0.495: 7 -1,-1.552; 12 1,-1.552; 19 1,1.552; 24 -1,1.552 | smd 0.25 x 0.6: 8 -0.6,-1.5; 9 -0.2,-1.5; 10 0.2,-1.5; 11 0.6,-1.5; 20 0.6,1.5; 21 0.2,1.5; 22 -0.2,1.5; 23 -0.6,1.5
MODULE_ESP32-WROOM-32D = smd 2 x 0.9: 1 -8.5,5.26; 2 -8.5,3.99; 3 -8.5,2.72; 4 -8.5,1.45; 5 -8.5,0.18; 6 -8.5,-1.09; 7 -8.5,-2.36; 8 -8.5,-3.63; 9 -8.5,-4.9; 10 -8.5,-6.17; 11 -8.5,-7.44; 12 -8.5,-8.71; 13 -8.5,-9.98; 14 -8.5,-11.25; 25 8.5,-11.25; 26 8.5,-9.98; 27 8.5,-8.71; 28 8.5,-7.44; 29 8.5,-6.17; 30 8.5,-4.9; 31 8.5,-3.63; 32 8.5,-2.36; 33 8.5,-1.09; 34 8.5,0.18; 35 8.5,1.45; 36 8.5,2.72; 37 8.5,3.99; 38 8.5,5.26 | smd 0.9 x 2: 15 -5.715,-12.25; 16 -4.445,-12.25; 17 -3.175,-12.25; 18 -1.905,-12.25; 19 -0.635,-12.25; 20 0.635,-12.25; 21 1.905,-12.25; 22 3.175,-12.25; 23 4.445,-12.25; 24 5.715,-12.25 | smd 1.33 x 1.33: 39_1 -2.835,-0.405; 39_2 -1,-0.405; 39_3 0.835,-0.405; 39_4 -2.835,-2.24; 39_5 -1,-2.24; 39_6 0.835,-2.24; 39_7 -2.835,-4.075; 39_8 -1,-4.075; 39_9 0.835,-4.075 | drill 0.2 pad 0.3: 39_10 -1.917,-0.405; 39_11 -0.083,-0.405; 39_12 -2.835,-1.323; 39_13 -1,-1.323; 39_14 0.835,-1.323; 39_15 -1.917,-2.24; 39_16 -0.083,-2.24; 39_17 -2.835,-3.158; 39_18 -1,-3.158; 39_19 0.835,-3.158; 39_20 -1.917,-4.075; 39_21 -0.083,-4.075
QFN50P400X400X80-21N = smd 0.84 x 0.27: 1 -1.935,1; 2 -1.935,0.5; 3 -1.935,0; 4 -1.935,-0.5; 5 -1.935,-1; 11 1.935,-1; 12 1.935,-0.5; 13 1.935,0; 14 1.935,0.5; 15 1.935,1 | smd 0.27 x 0.84: 6 -1,-1.935; 7 -0.5,-1.935; 8 0,-1.935; 9 0.5,-1.935; 10 1,-1.935; 16 1,1.935; 17 0.5,1.935; 18 0,1.935; 19 -0.5,1.935; 20 -1,1.935 | smd 2 x 2: 21 0,0
SC70 = smd 0.4 x 0.75: 1 -0.65,-0.825; 2 0,-0.825; 3 0.65,-0.825; 4 0.65,0.825; 5 -0.65,0.825
SMT-JUMPER_3_2-NC_TRACE_NO-SILK = smd 0.635 x 1.27: 1 -1.016,0; 2 0,0; 3 1.016,0

### Placement (x,y rotation side)
AD0  18.41,10.16 180 bottom
B1  12.19,41.27 0 bottom
BATT  2.22,6.99 90 top
BOOT  30.35,20.45 270 top
BTN1  29.59,32.26 0 top
BTN2  29.59,35.18 0 top
BUZZER  26.04,6.35 270 top
C1  10.16,15.88 0 bottom
C2  10.16,17.14 180 bottom
C3  10.16,14.61 180 bottom
C4  9.53,3.17 270 bottom
C5  5.71,18.41 180 top
C6  5.33,10.29 270 bottom
C7  31.75,6.99 180 bottom
C8  9.53,13.34 180 top
C9  9.53,12.06 180 top
C10  31.75,5.71 180 bottom
C11  31.75,8.26 180 bottom
C12  31.75,4.45 180 bottom
C13  31.75,15.88 0 top
C14  31.75,14.61 180 top
C15  31.75,13.34 0 top
C16  25.4,18.41 90 top
C17  24.13,18.41 270 top
C18  18.41,6.35 0 top
C19  14.61,10.16 0 bottom
C20  18.41,7.62 0 top
C21  5.71,13.34 0 top
C22  22.86,4.45 180 bottom
C23  22.86,5.71 180 bottom
C24  22.86,6.99 180 bottom
C25  17.14,17.14 270 top
C26  12.06,17.14 90 top
C27  9.53,10.79 0 top
D1  10.79,3.05 270 top
D2  30.61,42.42 270 top
IC1  5.71,15.88 270 bottom
IC2  10.16,7.62 90 top
IC3  27.94,15.24 0 bottom
J4  17.14,1.55 0 top
M1  2.54,31.75 0 top
OLED  3.81,20.95 90 top
PWR  29.59,29.34 0 top
Q1  5.71,8.26 90 top
Q2  28.32,4.38 180 bottom
Q3  22.23,15.24 90 top
Q4  7.94,3.05 90 top
Q5  2.54,35.56 270 bottom
Q7  22.23,12.06 90 top
Q8  14.61,17.14 90 top
R1  10.16,18.41 0 bottom
R2  10.16,13.34 180 bottom
R3  12.7,6.99 90 top
R4  10.79,3.17 90 bottom
R5  9.53,18.41 180 top
R6  19.68,12.06 90 top
R7  7.62,10.29 90 bottom
R8  6.48,10.29 270 bottom
R9  20.32,38.05 180 bottom
R10  24.77,15.24 270 top
R11  24.77,12.06 270 top
R12  19.68,15.24 270 top
R13  4.7,35.94 90 bottom
R14  28.32,6.6 0 bottom
R15  21.59,18.41 90 top
R16  22.86,18.41 90 top
R17  20.32,18.41 270 top
R18  19.05,18.41 90 top
R19  20.32,32.79 0 bottom
R20  20.32,33.86 0 bottom
R21  15.24,6.35 180 top
R22  12.95,15.75 270 bottom
R23  16.26,15.75 90 bottom
R24  15.24,7.62 180 top
R25  30.61,38.43 0 top
R26  20.32,34.92 0 bottom
R27  20.32,35.97 0 bottom
R28  20.32,37.01 180 bottom
R29  30.61,39.47 0 top
R30  30.61,40.51 0 top
RST  30.35,25.02 90 top
U1  6.15,6.48 270 bottom
U2  9.53,15.88 180 top
U4  27.94,13.34 0 top
U5  17.14,34.8 0 top
U6  14.61,12.06 0 top
U7  5.71,15.88 180 top
U$1  31.75,11.43 90 top
VCC  18.41,13.64 270 bottom

### Tracks (layer width: path | path; a pad name or v marks a point on that pad's centre or on a via)
1.8V
  Top 0.203: 31.1,13.31 31.1,12.93 31.53,12.5 31.53,11.38 U$1.5
  Top 0.254: R11.2 24.7,11.5 | 24.7,11.5 24.32,11.12 Q7.1 22.7,11.12 22.23,11.59 22.23,13.97 22.55,14.29 Q3.1 24.32,14.29 R10.2 | 24.7,11.5 25.02,11.18 27.16,11.18 27.34,11.36 | U4.13 30.12,12.34 31.1,13.31 C15.1 32.37,14.61 C14.1 | U$1.5 27.92,10.78 27.34,11.36 | U4.8 27.34,11.36
3.3V_ESP  (via drill 0.2)
  Top 0.254: C9.1 C8.1 10.47,13.63 U2.5 10.47,15.94 11,16.47 11,18.45 7.01,22.44 7.01,26.9 7.24,27.13 7.24,36.91 v6.99,37.16 7.01,37.16 7.01,37.69 7.54,38.22 8.08,38.22 U5.2 | v18.73,35.88 v12.38,35.88 17.63,41.12 26.2,41.12 27.92,42.84 D2.4
  Bottom 0.203: 19.82,35.95 20.82,36.95
  Bottom 0.254: R26.2 R27.2 | v12.38,35.88 11.1,37.16 v6.99,37.16 | R27.2 19.82,35.95 | 20.82,36.95 R28.2 | v18.73,35.88 18.82,35.97 R27.2
3V3OUT  (via drill 0.2)
  Top 0.254: U6.11 16.54,9.49 v16.56,9.47 15.9,10.13 U6.10 | U6.20 13.18,14.43 v12.19,14.43
  Bottom 0.254: v12.19,14.43 16.56,10.06 v16.56,9.47 15.88,10.16 C19.1
AD0  (via drill 0.2)
  Top 0.254: U4.9 27.74,12.9 v27.3,13.34
  Bottom 0.254: v27.3,13.34 22,13.34 AD0.2
B-
  Top 0.254: Q1.3 Q1.2 5.39,6.04 4.44,6.99 BATT.1
BATT_MONITOR  (via drill 0.2)
  Top 0.254: C17.1 23.01,19.07 R16.2 R15.2 v21.59,19.84 | v24.13,26.83 20.95,30 v19.68,30 | U5.6 11.09,33.71 13.02,31.78 v13.02,30.64
  Bottom 0.254: v13.02,30.64 13.65,30 v19.68,30 | v24.13,26.83 24.13,22.38 v21.59,19.84
BLUE  (via drill 0.2)
  Top 0.254: v27.3,29.53 26.93,29.9 U5.30 | v29.21,40.64 29.98,40.64 R30.1
  Bottom 0.254: v27.3,29.53 27.46,29.53 29.97,27.02 32.04,27.02 34.02,29 34.02,35.83 v29.21,40.64
BUZZER  (via drill 0.2)
  Top 0.254: U5.11 8.11,27.36 7.39,26.64 7.39,22.99 10.16,20.22 14.96,20.22 16,19.18 v17.91,19.18
  Bottom 0.254: R14.1 28.82,7.37 27.91,8.27 27.91,13.59 27.56,13.94 21.23,13.94 18.16,17.02 18.16,18.92 v17.91,19.18
CHARGER  (via drill 0.2)
  Top 0.254: R18.2 R17.1 v20.32,19.84 | v22.92,26.83 20.38,29.37 12.44,29.37 10.79,31.02 10.79,31.05 9.41,32.44 U5.7
  Bottom 0.254: v22.92,26.83 22.92,22.45 v20.32,19.84
CHARGER_EN  (via drill 0.2)
  Top 0.254: U5.8 9.82,31.17 v10.16,30.83 | v1.66,20.3 1.08,19.71 1.08,17.02 v2.93,15.17
  Bottom 0.254: v2.93,15.17 2.93,14.05 3.81,13.18 IC1.8 | v10.16,30.83 9.81,30.48 4.03,30.48 1.61,28.07 1.61,20.34 v1.66,20.3
DTR  (via drill 0.2)
  Top 0.254: Q8.1 15.53,15.53 v15.11,15.11 14.61,14.61 U6.18
  Bottom 0.254: R22.2 13,15.25 13.61,14.63 14.63,14.63 v15.11,15.11
EN  (via drill 0.2)
  Top 0.254: C25.1 Q8.3 15.14,17.8 15,17.65 v14.61,17.65 | v17.78,20.16 v15.88,20.16 15.4,20.64 14.61,20.64 v14.29,20.95 | RST.1 30.34,24.22 v30.38,24.18 30.42,24.22 RST.2 33.05,24.22 v33.37,24.54 | v10.79,36.2 9.47,37.52 U5.3 | v16.51,36.51 18.96,36.51 20.32,35.15 v20.32,30.8
  Bottom 0.254: v17.78,20.16 19.05,18.89 19.05,16.67 19.43,16.28 23.55,16.28 24.89,17.62 29.39,17.62 30.4,18.64 30.4,24.16 v30.38,24.18 | v15.88,20.16 15.88,18.92 v14.61,17.65 | v14.29,20.95 19.05,25.72 19.05,28.48 20.32,29.75 v20.32,30.8 | v16.51,36.51 15.27,35.27 11.72,35.27 v10.79,36.2
GND  (via drill 0.2)
  Top 0.203: 30.88,14.35 30.61,14.35
  Top 0.254: RST.4 RST.3 | BOOT.4 BOOT.3 25.98,19.65 C16.2 | U2.2 9.53,15.88 | 9.53,15.88 9.53,13.98 C8.2 C9.2 10.14,10.79 C27.2 10.32,10.79 | C20.2 C18.2 19.05,6.33 v19.05,5.33 | v19.05,5.33 18.45,4.73 J4.5 | C26.2 v12.06,18.67 13.05,19.66 14.98,19.66 16.07,18.57 18.39,18.57 18.59,18.36 18.6,18.36 R18.1 19.05,17.78 17.78,16.51 C25.2 | C13.2 32.4,15.76 33,15.16 33,14.05 32.4,13.45 C15.2 33.5,12.24 v33.5,12.06 32.86,11.43 U$1.2 | C13.2 31.13,14.61 | 31.13,14.61 C14.2 | U4.20 28.56,14.86 28.56,15.24 28.71,15.39 29.57,15.39 30.61,14.35 29.88,14.35 29.86,14.34 U4.18 | C17.2 22.86,17.78 R16.1 | C17.2 C16.2 | C17.2 | 10.32,10.79 11.59,12.06 U6.3 U6.21 U6.13 | R3.1 12.7,6.51 v13.65,6.51 13.3,6.86 13.3,7.96 12.16,9.1 12.02,9.1 10.32,10.79 | U5.15 v11.43,20.83 | U5.39_12 U5.39_4 | U5.39_4 U5.39_15 | U5.39_4 U5.39_17 U5.39_7 U5.39_20 U5.39_8 | U5.39_19 U5.39_9 U5.39_21 U5.39_8 | U5.39_2 U5.39_11 U5.39_3 U5.39_14 U5.39_6 U5.39_16 | U5.39_2 U5.39_10 U5.39_1 13.43,35.27 12.13,35.27 11.77,35.63 11.77,37.47 9.75,39.49 9.21,39.49 U5.1 | OLED.3 2.79,26.04 2.29,26.54 2.29,29.81 3.73,31.26 3.73,32.33 v5.71,34.31 5.71,37.67 8.11,40.06 U5.1 | v19.05,5.33 v24.77,5.33 28.12,5.33 v29.11,4.34 30.96,4.34 v31.75,3.56 | Q1.6 Q1.7 5.39,11.79 4.99,12.19 3,12.19 v2.52,12.68 | U5.39_2 U5.39_13 U5.39_5 U5.39_18 U5.39_8 | v5.71,24.89 5.71,21.82 6.32,21.21 6.32,19.84 v6.35,19.81 4.95,18.41 C5.2 5.71,17.77 U7.2 5.71,16.89 6.73,15.88 9.53,15.88 | IC2.6 7.93,6.67 v7.78,6.83 | 30.88,14.35 31.13,14.61 | C13.2 32.4,16.84 32.67,17.12 32.67,17.87 32.4,18.15 BOOT.4 | Q1.6 6.04,9.75 v5,8.71 | Q1.6 6.04,13.01 C21.2 | BTN2.2 BTN1.2 PWR.2 32.4,29.07 RST.3
  Top 0.254: BOOT.4 32.75,19.65 33.98,20.88 33.98,24.8 33.62,25.15 33.07,25.15 RST.3 | C16.2 26.18,18.29 v26.54,18.29 | v27.69,39.75 27.38,40.06 U5.38 | U5.1 8.58,40.06 v7.37,41.27
  Bottom 0.254: C24.2 C23.2 | C22.2 C23.2 | 10.78,17.14 C2.2 | v13.65,6.51 13.81,6.67 13.81,10.02 C19.2 | v12.06,18.67 11.43,19.3 v11.43,20.83 | v5.71,34.31 3.83,34.31 Q5.2 | R1.1 10.91,18.67 v12.06,18.67 | R1.1 10.78,18.3 10.78,17.14 | v12.06,18.67 12.06,18.07 11.64,17.64 11.64,15.43 C3.2 | AD0.1 18.01,9.22 19.05,8.18 v19.05,5.33 19.4,5.33 21.75,7.69 22.66,7.69 22.81,7.54 22.81,3.89 22.66,3.74 13.52,3.74 12.45,2.67 R4.1 10.64,2.52 C4.2 8.43,2.52 7.27,3.69 7.27,4.33 7.5,4.57 7.5,6.55 v7.78,6.83 7.75,6.86 6.53,6.86 U1.EP | Q2.2 29.27,4.51 v29.11,4.34 | C23.2 24.38,5.71 v24.77,5.33 | v31.75,3.56 32.4,4.21 C12.2 C10.2 C7.2 C11.2 33.02,8.88 33.02,11.59 v33.5,12.06 | U1.EP 5.4,7.23 U1.1 5.4,8.32 v5,8.71 5.33,9.04 C6.2 | v6.35,19.81 IC1.3 5.68,17.96 5.68,17.87 5.54,17.72 4.62,17.72 4.48,17.87 4.48,17.96 IC1.1 2.33,17.14 2.33,12.86 v2.52,12.68 2.97,12.22 4.26,12.22 4.41,12.37 4.41,13.82 4.7,14.11 7.63,14.11 10.21,16.69 10.21,17.97 R1.1 | OLED.3 5.21,26.04 5.71,25.53 v5.71,24.89 | U5.39_11 17.14,34.48 17.14,35.84 19.36,38.05 R9.1 | U1.4 6.9,7.23 U1.EP | IC3.13 28.57,18.54 28.07,18.03 26.8,18.03 v26.54,18.29 | v27.69,39.75 32.13,35.31 BTN2.2 | B1.2 v7.37,41.27 | C1.2 10.78,17.14
  pour Bottom: -0.89,49.91 34.04,49.91 37.47,46.48 37.47,2.41 32,-3.05 2.03,-3.05 -1.65,0.64 -1.65,49.15
GPIO15  (via drill 0.2)
  Top 0.254: v21.91,24.13 21.75,23.97 21.75,22.7 21.59,22.7 U5.23
  Bottom 0.254: v21.91,24.13 22.29,24.51 22.29,30.45 24.54,32.7 27.11,32.7 29.53,35.12 | BTN2.1 29.53,35.12 | R27.1 28.68,35.97 29.53,35.12
GPIO27  (via drill 0.2)
  Top 0.254: v10.95,26.99 10.48,26.51 9.86,26.51 9.43,26.09 U5.12 | v11.56,32.38 v11.56,31.11 | v2.22,24.83 0.64,26.42 v0.64,36.83 | v30.85,33.71 29.59,32.45 BTN1.1
  Bottom 0.254: v11.56,31.11 11.56,28.45 10.98,27.87 | v10.95,26.99 10.98,27.02 10.98,27.87 | v2.22,24.83 2.29,24.77 4.76,24.77 5.24,24.28 6.12,24.28 10.09,28.26 10.6,28.26 10.98,27.87 | v30.85,33.71 32.35,33.71 33.33,34.69 33.33,35.67 28.99,40.01 28.98,40.01 25.48,43.51 3.02,43.51 0.64,41.13 v0.64,36.83 | v11.56,32.38 13.66,32.38 13.9,32.63 14.44,32.63 14.98,33.17 15.48,33.17 15.78,32.87 16.4,32.87 17.67,34.14 17.67,35.67 19,37.01 R28.1
GREEN
  Top 0.254: U5.29 27.27,28.63 28.23,29.59 28.23,33.91 27.53,34.61 27.4,34.61 27.02,34.99 27.02,36.38 R29.1
IO0  (via drill 0.2)
  Top 0.254: BOOT.1 BOOT.2 27.03,21.25 25.64,22.63 | C26.1 Q8.6 13.8,16.5 13.97,16.67 v14.61,16.67 | v16.51,20.92 23.94,20.92 25.64,22.63 | 25.64,22.63 U5.25
  Bottom 0.254: v14.61,16.67 16.51,18.57 v16.51,20.92
LOAD_EN  (via drill 0.2)
  Top 0.254: U5.27 18.47,26.09 v18.41,26.04 | U7.3 4.76,17.56 4.21,18.11 4.21,18.94 5.46,20.19 5.46,20.7 v5.71,20.95
  Bottom 0.254: v18.41,26.04 11.81,26.04 6.73,20.95 v5.71,20.95
MOTOR  (via drill 0.2)
  Top 0.254: v6.48,33.1 6.48,29.97 v6.35,29.84 | v10.16,28.89 10,28.73 8.75,28.73 U5.10
  Bottom 0.254: v6.35,29.84 6.73,29.46 9.59,29.46 v10.16,28.89 | R13.1 5.93,35.44 6.48,34.9 v6.48,33.1
N$1
  Bottom 0.254: IC1.2 5.74,19.29 5.74,20.06 6.1,20.42 7.18,20.42 9.19,18.41 R1.2
N$2
  Top 0.254: IC2.3 11.18,8.57 10.16,7.55 10.16,6.74 9.56,6.14 7.6,6.14 6.69,7.05 Q1.5
N$3  (via drill 0.2)
  Top 0.254: v10.16,9.65 10.16,8.26 9.53,7.62 IC2.5
  Bottom 0.203: 10.81,15.73 10.23,15.15 10.23,14.06 10.66,13.63 R2.2
  Bottom 0.254: 10.81,15.73 C1.1 | R2.2 10.66,10.15 v10.16,9.65
N$4
  Top 0.254: IC2.1 10.66,6.67 9.65,5.66 6.98,5.66 Q1.4
N$5
  Top 0.254: IC2.2 12.56,7.62 R3.2
N$6
  Bottom 0.254: U1.3 6.4,8.31 7.62,9.54 R7.1
N$7
  Bottom 0.254: U1.2 5.9,8.5 6.48,9.08 R8.2 6.03,10.23 6.02,10.23 5.33,10.92 C6.1
N$8
  Top 0.254: U2.4 8.57,14.29 8.26,13.97 8.26,11.41 C27.1
N$9  (via drill 0.2)
  Top 0.254: v27.62,35.24 27.94,35.56 27.94,36.2 v28.89,37.15 | v27.3,33.97 27.62,33.66 v27.62,32.07
  Bottom 0.254: IC3.14 29.84,20.95 26.32,24.48 26.32,30.99 27.4,32.07 v27.62,32.07 | v27.3,33.97 27.62,34.29 v27.62,35.24 | v28.89,37.15 24.77,41.27 20.32,41.27 B1.1 16.51,41.27 14.28,39.04 8.74,39.04 6.51,41.27 B1.3
N$10  (via drill 0.2)
  Top 0.254: R6.2 19.56,12.56 18.68,11.68 v18.41,11.68
  Bottom 0.254: VCC.3 v18.41,11.68
N$11  (via drill 0.2)
  Top 0.254: C13.1 v30.1,15.88 | U4.10 28.14,13.54 v28.57,13.97
  Bottom 0.254: v30.1,15.88 28.96,14.73 28.96,14.35 v28.57,13.97
N$12  (via drill 0.2)
  Top 0.254: v18.41,15.49 18.8,15.49 19.56,14.74 R12.2
  Bottom 0.254: VCC.1 v18.41,15.49
N$13
  Bottom 0.254: Q5.1 4.63,36.51 R13.2
N$14
  Bottom 0.254: Q2.1 27.37,6.15 R14.2
N$15  (via drill 0.2)
  Top 0.254: Q8.5 v12.88,17.14
  Bottom 0.254: R22.1 12.88,16.32 v12.88,17.14
N$16
  Top 0.254: C18.1 17.75,6.35 17.39,6.7 16.09,6.7 R21.1 15.74,5.98 16.5,5.22 J4.2
N$17
  Bottom 0.254: M1.1 1.44,32.85 Q5.3
N$18  (via drill 0.2)
  Top 0.254: Q8.2 v16.33,17.14
  Bottom 0.254: R23.2 16.26,17.07 v16.33,17.14
N$19
  Bottom 0.254: Q2.3 27.25,4.35 BUZZER.M
N$20
  Top 0.203: 14.74,6.65 14.21,7.17 14.21,9.11 13.97,9.35 13.39,9.35 13.11,9.63 13.11,10.62 13.27,10.78 14.94,10.78 15.11,10.62 U6.9
  Top 0.254: 14.74,6.65 R21.2
N$21  (via drill 0.2)
  Top 0.254: C20.1 v16.64,7.62 R24.1 | v16.64,6.1 17.14,5.59 J4.3
  Bottom 0.254: v16.64,6.1 v16.64,7.62
N$22
  Top 0.254: R24.2 14.61,7.75 U6.8
N$23
  Top 0.254: R5.2 8.57,17.96 U2.3
N$24
  Top 0.254: D2.1 31.6,42.57 31.86,42.57 32.05,42.39 32.05,39.37 R25.2
N$25
  Top 0.254: U7.4 4.76,13.63 C21.1
N$26
  Top 0.254: D2.2 31.66,41.66 31.66,40.03 R29.2
N$27
  Top 0.254: D2.3 31.11,40.77 R30.2
PWR  (via drill 0.2)
  Top 0.254: PWR.1 29.59,28.45 27.56,26.42 27.56,26.19 26.18,24.82 U5.26 | v24.13,38.1 23.43,38.1 21.3,35.97 21.3,33.63 v21.91,33.02
  Bottom 0.254: v21.91,33.02 22.52,33.63 22.52,34.22 21.82,34.92 R26.1 | v24.13,38.1 25.72,38.1 27.3,36.51 29.95,36.51 30.79,35.67 30.79,34.67 30.12,34.01 30.12,33.43 30.79,32.77 30.79,30.53 PWR.1
QST  (via drill 0.2)
  Top 0.254: v21.72,38.73 21.77,38.79 U5.37
  Bottom 0.254: R9.2 21.03,38.05 v21.72,38.73 15.75,38.73 14.86,37.85 2.52,37.85 0.6,35.93 0.6,4.45 1.42,3.63 5.4,3.63 6.4,4.63 U1.6
RED  (via drill 0.2)
  Top 0.254: v30.8,27.62 30.15,26.98 v29.03,26.98 | v33.41,33.73 33.41,35.59 32.17,36.83 31.7,36.83 R25.1 | v27.3,27.62 27.04,27.36 U5.28
  Bottom 0.254: v27.3,27.62 27.95,26.98 v29.03,26.98 | v30.8,27.62 32.1,27.62 33.41,28.93 v33.41,33.73
RTS  (via drill 0.2)
  Top 0.254: U6.19 14.11,14.47 13.97,14.61 v13.97,15.24 | Q8.4 13.69,18.38 v14.22,18.92
  Bottom 0.254: R23.1 16.2,15.25 15.6,15.85 14.58,15.85 v13.97,15.24 13.97,18.67 v14.22,18.92
RXD  (via drill 0.2)
  Top 0.254: U6.1 12.21,13.06 v11.56,13.72 | v21.72,31.75 22.04,31.75 24.13,33.84 24.13,34.54 24.56,34.98 U5.34
  Bottom 0.254: v21.72,31.75 21.46,31.5 21.46,27.1 12.45,18.08 12.45,17.91 12.02,17.48 12.02,15.27 11.56,14.81 v11.56,13.72
SCL  (via drill 0.2)
  Top 0.254: R12.1 20.62,15.74 Q3.3 v22.07,15.24 | v27.3,37.59 25.72,37.59 U5.36 25.14,37.52 25.05,37.47 23.65,37.47 21.91,35.72 v21.91,33.97 22.52,33.36 22.52,32.77 22.13,32.38 21.49,32.38 21.11,32 21.11,31.5 22.13,30.48 v23.18,30.48 | v30.8,17.3 31.11,17.62 v32.07,17.62 | v27.3,22.54 27.5,22.35 v33.27,22.35 | v4.19,38.46 2.54,36.8 v2.54,36.3
  Bottom 0.254: OLED.1 3.81,20.52 1.72,18.44 | v32.07,17.62 32.38,17.94 IC3.16 32.38,21.46 v33.27,22.35 | v2.54,36.3 2.54,34.16 3.73,32.97 3.73,31.2 0.98,28.44 0.98,19.18 1.72,18.44 | v30.8,17.3 30.64,17.14 25.02,17.14 23.11,15.24 v22.07,15.24 | v27.3,37.59 25.55,39.34 15.75,39.34 14.87,38.46 v4.19,38.46 | v23.18,30.48 25.4,28.26 25.4,24.45 v27.3,22.54 | R20.1 20.93,33.97 v21.91,33.97 | 1.72,18.44 1.03,17.74 1.03,4.56 1.58,4.01 5.24,4.01 5.9,4.67 U1.7
SCL_IMU
  Top 0.254: Q3.2 23.68,15.74 R10.1 26.33,15.74 26.46,15.88 26.95,15.88 27.32,15.51 27.32,14.85 U4.23
SDA  (via drill 0.2)
  Top 0.254: R6.1 20.62,11.56 | 20.62,11.56 20.35,11.29 v23.27,8.38 24.21,7.44 29.77,7.44 30.33,8 v30.33,9.04 v30.32,9.05 | 20.62,11.56 Q7.3 | v20,28.57 19.05,27.62 v10.32,27.62 | v27.3,31.11 27.3,31.43 26.99,31.75 26.99,33.02 26.3,33.71 U5.33 | v6.67,1.65 4.8,1.65 v1.78,4.67 0.65,5.8 0.65,20.59 v2.29,22.23
  Bottom 0.254: v30.32,9.05 30.48,9.21 30.48,12.54 31.41,13.47 31.41,19.39 31.11,19.68 IC3.15 31.11,24.79 29.87,26.04 28.03,26.04 26.7,27.37 26.7,30.51 v27.3,31.11 | v10.32,27.62 6.19,23.5 OLED.2 3.56,23.5 v2.29,22.23 | v20,28.57 20.95,29.53 20.95,32.66 R19.1 | v6.67,1.65 12.13,1.65 13.65,3.17 23.47,3.17 25.37,5.08 25.37,6.99 23.98,8.38 v23.27,8.38 | U1.8 4.72,4.4 2.06,4.4 v1.78,4.67
SDA_IMU
  Top 0.254: Q7.2 23.68,12.56 R11.1 24.77,13.64 26.62,15.49 26.8,15.49 26.94,15.35 U4.24
SHIELD
  Top 0.254: J4.6 13.6,2.55 J4.8 14.82,2.74 J4.10 J4.11 19.46,2.74 J4.9 20.75,2.5 J4.7
TXD  (via drill 0.2)
  Top 0.254: v17.14,14.61 17.1,14.61 15.82,13.33 15.38,13.33 15.22,13.49 15.22,13.89 U6.17 | U5.35 23.96,36.25 23.11,35.4 v23.11,35.05
  Bottom 0.254: v17.14,14.61 17.14,22.18 21.84,26.88 21.84,30.77 23.11,32.03 v23.11,35.05
VBAT  (via drill 0.2)
  Top 0.254: R15.1 21.59,17.78 22.23,17.14 24.77,17.14 25.24,17.62 25.4,17.62 C16.1 25.4,16.93 v25.93,16.41 | Q4.3 6.91,3.02 v5.87,3.02 5.42,3.02 v3.43,5
  Bottom 0.254: R2.1 9.66,14.46 C3.1 9.1,14.61 IC1.5 7.62,12.95 6.73,12.06 6.48,12.06 | R8.1 6.48,12.06 | 6.48,12.06 4.76,12.06 BATT.2 3.43,8.32 v3.43,5 | v25.93,16.41 26.61,16.41 26.77,16.56 30.27,16.56 30.71,16.13 30.71,13.4 29.21,11.91 29.21,9.37 28.73,8.88 28.73,8.1 29.93,6.91 29.93,3.68 26.61,0.36 6.75,0.36 5.87,1.24 v5.87,3.02
VBUS  (via drill 0.2)
  Top 0.254: Q4.1 9.52,1.52 D1.A 11.68,1.52 12.06,1.91 12.06,4.45 12.7,5.08 v13.84,5.08 15.18,5.08 15.85,4.42 J4.1 | v2.93,16.1 1.69,17.34 v1.69,19.36 | R17.2 20.32,17.65 v19.68,17.02 18.94,17.02 17.81,15.89 17.81,14.99 17.83,14.97 17.83,12.09 17.3,11.56 | v20.16,24.29 11.75,24.29 v10.16,25.88 | U6.12 17.3,11.56 | v17.68,8.69 17.68,11.19 17.3,11.56
  Bottom 0.254: C24.1 C23.1 C22.1 14.48,4.45 v13.84,5.08 | C2.1 9.1,17.14 IC1.4 7.62,18.54 6.41,17.33 3.91,17.33 2.93,16.35 v2.93,16.1 | R4.2 12.44,3.67 v13.84,5.08 | v17.68,8.69 17.3,8.3 16.46,8.3 15.88,7.72 15.88,7.11 v13.84,5.08 | v1.69,19.36 2.54,20.21 2.54,21.37 3.39,22.23 5.56,22.23 9.21,25.88 v10.16,25.88 | v20.16,24.29 19.68,23.81 v19.68,17.02
VCC  (via drill 0.2)
  Top 0.203: U$1.1 32.35,11 32.1,11 31.97,11.13 31.97,11.72 32.1,11.86 32.35,11.86 U$1.3
  Top 0.254: U$1.1 31.86,10.78 31.41,10.33 27.22,10.33 26.04,9.14 | v19.68,13.65 20.62,12.72 21.68,12.72 21.83,12.57 21.83,11.3 22.8,10.33 24.85,10.33 26.04,9.14 | v7.49,11.68 7.49,13.75 U7.5 4.92,16.32 4.38,16.32 3.83,16.88 3.83,19.1 5,20.27 5,28.02 4.45,28.57 | 4.45,28.57 OLED.4 | M1.2 5.08,29.21 4.45,28.57 | v29.46,8.26 29.37,8.35 BUZZER.P 26.04,9.14
  Bottom 0.254: C12.1 C10.1 C7.1 C11.1 | v7.49,11.68 7.62,11.56 R7.2 7.93,10.79 9.68,9.04 10.64,9.04 12.46,10.86 14.41,10.86 14.56,10.71 14.56,9.16 14.9,8.82 16.92,8.82 17.22,9.12 17.22,13.31 17.55,13.64 VCC.2 18.43,13.65 v19.68,13.65 | C11.1 31.1,10.62 IC3.2 | C11.1 v29.46,8.26 | R20.2 R19.2 19.28,32.25 17.73,32.25 17.43,31.95 16.7,31.95 16.4,32.25 15.89,32.25 15.6,31.95 14.86,31.95 14.56,32.25 14.06,32.25 13.56,31.75 M1.2
  pour Top: -0.51,49.02 34.67,49.02 35.81,47.88 35.81,1.4 33.15,-1.27 1.02,-1.27 -0.25,0 -0.51,0.25
VIN  (via drill 0.2)
  Top 0.254: U2.1 10.47,17.96 R5.1 10,18.41 10,18.73 9.21,19.53 7.46,19.53 | D1.C 9.65,4.58 9.07,4 Q4.2 7.93,4 v7.87,3.94 7.78,3.84 7.78,2.71 7.48,2.41 5.11,2.41 1.03,6.49 1.03,10.02 1.87,10.86 v1.87,11.59 | v6.41,22.13 7.46,21.08 7.46,19.53 | U7.1 6.67,18.11 C5.1 7.46,19.51 7.46,19.53
  Bottom 0.254: C4.1 7.99,3.83 v7.87,3.94 | v1.87,11.59 1.87,18.05 3.51,19.68 4.23,19.68 5.08,20.54 5.08,21.18 6.03,22.13 v6.41,22.13

### Text on the board
tNames: GND | VCC | VCC | GND | SDA | SCL | B+
bNames: B+ | B-